# Altium schematic sheet conn_isouart.SchDoc
size A
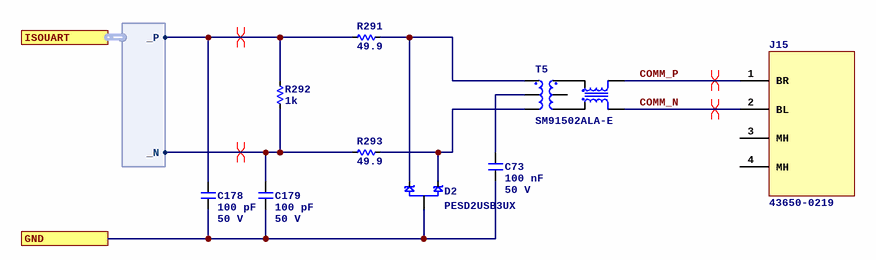
[diagram p0: conn_isouart.SchDoc]

## Parts
C73  Capacitance: 100 nF  Voltage Rating: 50 V  [C0402]  (hidden comment: CL05B104KB54PNC)
C178  Capacitance: 100 pF  Voltage Rating: 50 V  [C0402]  (hidden comment: CC0402KRX7R9BB101)
C179  Capacitance: 100 pF  Voltage Rating: 50 V  [C0402]  (hidden comment: CC0402KRX7R9BB101)
D2  PESD2USB3UX  [3SOT23]
J15  43650-0219  [MOLEX_MICROFIT_0436500219]
R291  value 49.9  [R0402]  (hidden comment: 0402WGF499JTCE)
R292  value 1k  [R0402]  (hidden comment: 0402WGF1001TCE)
R293  value 49.9  [R0402]  (hidden comment: 0402WGF499JTCE)
T5  SM91502ALA-E  [BOURNS_SM91502]

## Ports
GND, ISOUART (harness DIFF)

## Harnesses
DIFF: _P, _N

## Nets
COMM_N: J15.2(BL) T5.4
COMM_P: J15.1(BR) T5.6
GND: C73.2 C178.2 C179.2 D2.3 ; port GND
NetC73_1: C73.1 T5.2
NetC178_1: C178.1 R291.1 R292.2 ; port ISOUART._P
NetC179_1: C179.1 R292.1 R293.1 ; port ISOUART._N
NetD2_1: D2.1 R293.2 T5.3
NetD2_2: D2.2 R291.2 T5.1

Not connected (* = marked no-connect by the designer): J15 3(MH) 4(MH); T5 5

## Layout directives
differential pair; differential pair class DE_100: COMM_N, COMM_P, NetC178_1, NetC179_1

## Library data of the parts
C73 = CL05B104KB54PNC: Manufacturer: Samsung Electro-Mechanics; Dielectric: X7R; ComponentLink1URL: https://wmsc.lcsc.com/wmsc/upload/file/pdf/v2/lcsc/2304140030_Samsung-Electro-Mechanics-CL05B104KB54PNC_C307331.pdf; ComponentLink1Description: Datasheet; Manufacturer Part Number: CL05B104KB54PNC; Package: 0402; Supplier 2: LCSC; Supplier Part Number 2: C307331
C178 C179 = CC0402KRX7R9BB101: Manufacturer: YAGEO; Dielectric: X7R; Manufacturer Part Number: CC0402KRX7R9BB101; ComponentLink1URL: https://wmsc.lcsc.com/wmsc/upload/file/pdf/v2/lcsc/2304140030_YAGEO-CC0402KRX7R9BB101_C281751.pdf; ComponentLink1Description: Datasheet; Package: 0402; Supplier 2: LCSC; Supplier Part Number 2: C281751
D2 = PESD2USB3UX: DIODE ESD USB SOT-23; Manufacturer: Nexperia USA Inc.; Polarity: Unidirectional; Capacitance (pF): 0.7; Standoff (V): 3.3; Min Breakdown Voltage: 4.2 V; Supplier 1: DigiKey; Supplier Part Number 1: 1727-PESD2USB3UX-CT-ND; Manufacturer Part Number: PESD2USB3UX; Supplier 2: LCSC; Supplier Part Number 2: C3708426; ComponentLink1Description: Datasheet; ComponentLink1URL: https://assets.nexperia.com/documents/data-sheet/PESD2USB3UX-T.pdf; Supplier 3: Mouser; Supplier Part Number 3: 771-PESD2USB3UX-TR
J15 = 43650-0219: Connector Header Through Hole 2 position 0.118" (3.00mm); Manufacturer: Molex; Manufacturer Part Number: 43650-0219; ComponentLink1Description: Drawing; ComponentLink1URL: https://www.molex.com/content/dam/molex/molex-dot-com/products/automated/en-us/salesdrawingpdf/436/43650/436500219_sd.pdf; ComponentLink2Description: Product page; ComponentLink2URL: https://www.molex.com/en-us/products/part-detail/436500219; Supplier 1: DigiKey; Supplier Part Number 1: WM14583-ND; Supplier Part Number 2: C19170957; Supplier 2: LCSC; Supplier 3: Mouser; Supplier Part Number 3: 538-43650-0219
R291 R293 = 0402WGF499JTCE: Manufacturer: UNI-ROYAL(Uniroyal Elec); Tolerance: 1%; Temperature Coefficient: ±100ppm/?; Power Rating (mW): 62.5; Manufacturer Part Number: 0402WGF499JTCE; ComponentLink1Description: Datasheet; ComponentLink1URL: https://wmsc.lcsc.com/wmsc/upload/file/pdf/v2/lcsc/2205311900_UNI-ROYAL-Uniroyal-Elec-0402WGF499JTCE_C25120.pdf; Package: 0402; Supplier 2: LCSC; Supplier Part Number 2: C25120
R292 = 0402WGF1001TCE: Manufacturer: UNI-ROYAL(Uniroyal Elec); Tolerance: 1%; Temperature Coefficient: ±100ppm/?; Power Rating (mW): 62.5; Manufacturer Part Number: 0402WGF1001TCE; ComponentLink1Description: Datasheet; ComponentLink1URL: https://wmsc.lcsc.com/wmsc/upload/file/pdf/v2/lcsc/2206010216_UNI-ROYAL-Uniroyal-Elec-0402WGF1001TCE_C11702.pdf; Package: 0402; Supplier 2: LCSC; Supplier Part Number 2: C11702
T5 = SM91502ALA-E: 200µH LAN Pulse Transformer 1CT:1CT Surface Mount; Manufacturer: Bourns Inc.; Supplier 1: DigiKey; ComponentLink1URL: https://www.bourns.com/docs/product-datasheets/sm91502ala.pdf; ComponentLink1Description: Datasheet; Supplier Part Number 1: 118-SM91502ALA-ECT-ND; Manufacturer Part Number: SM91502ALA-E; Supplier 2: LCSC; Supplier Part Number 2: C5337144; Supplier 3: Mouser; Supplier Part Number 3: 652-SM91502ALA-E